# EasyEDA Pro project ProPrj_esp32无线遥控器_2025-02-07.epro

# Schematic Schematic1
Board Name: Board1; Create Date: 2024-12-05; Drawed: ZZRON
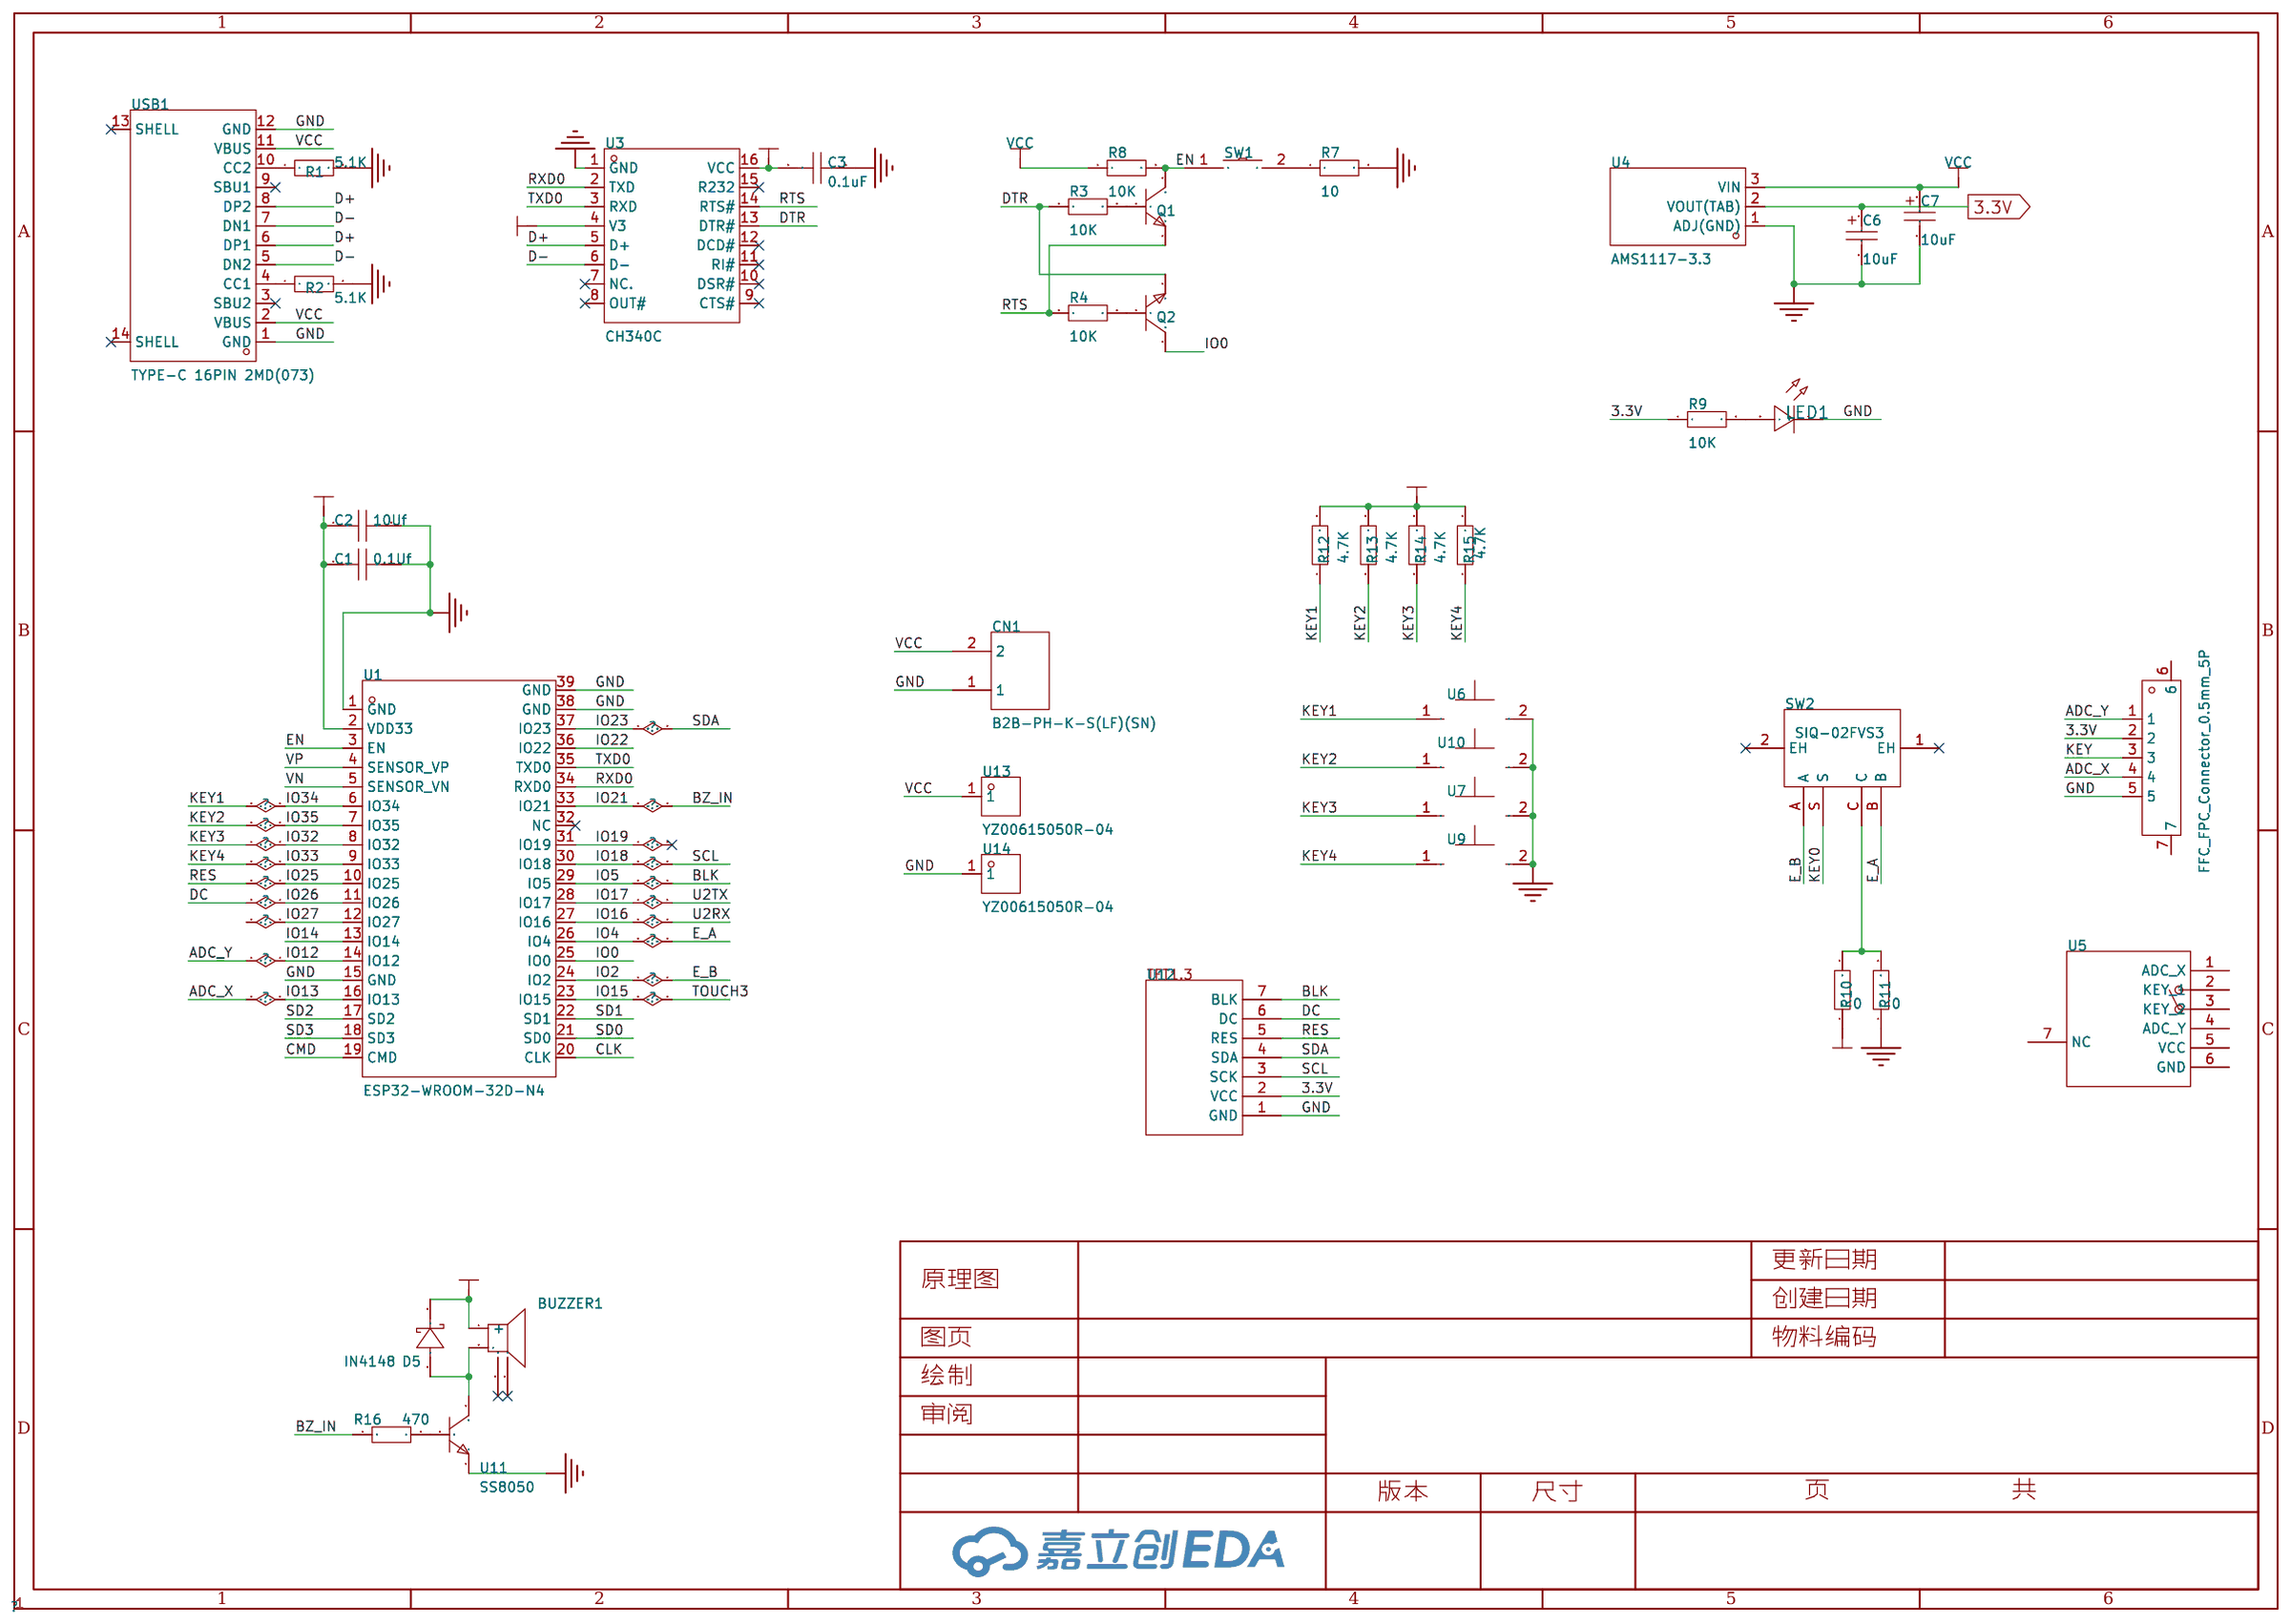
[diagram p0: schematic sheet]

## Parts
BUZZER1  2.7kHz  [BUZ-SMD_4P-L8.5-W8.5-P8.50-BR]
C1  0.1Uf  [C0603]
C2  10Uf  [C0603]
C3  0.1uF  [C0603]
C6  10uF  [CAP-SMD_L3.2-W1.6-RD-C7171]
C7  10uF  [CAP-SMD_L3.2-W1.6-RD-C7171]
CN1  B2B-PH-K-S(LF)(SN)  [CONN-TH_B2B-PH-K-S]
D5  IN4148  [SOD-123_L2.7-W1.6-LS3.7-FD]
FPC1  FFC_FPC_Connector_0.5mm_5P  [FPC-SMD_5P-P0.50-LIAN-FENG-YING]
LED1  -  [LED_0603]
Q1  -  [S8050_SOT-23]
Q2  -  [S8050_SOT-23]
R1  5.1K  [R0603]
R2  5.1K  [R0603]
R3  10K  [R0603]
R4  10K  [R0603]
R7  10  [R0603]
R8  10K  [R0603]
R9  10K  [R0603]
R10  0  [R0603]
R11  0  [R0603]
R12  4.7K  [R0603]
R13  4.7K  [R0603]
R14  4.7K  [R0603]
R15  4.7K  [R0603]
R16  470  [R0603]
SW1  TS-1101-C-W  [SW-SMD_L6.0-W3.3-LS8.0]
SW2  SIQ-02FVS3  [SW-SMD_SIQ-02FVS3]
U1  ESP32-WROOM-32D-N4  [WIFIM-SMD_39P-L25.5-W18.0-P1.27-BL]
U3  CH340C  [SOP-16_L10.0-W3.9-P1.27-LS6.0-BL]
U4  AMS1117-3.3  [SOT-89_L4.5-W2.5-P1.50-LS4.2-BR]
U5  -  [NS摇杆]
U6  SKPMAQE010  [KEY-SMD_2P-L6.0-W6.0-P6.00]
U7  SKPMAQE010  [KEY-SMD_2P-L6.0-W6.0-P6.00]
U9  SKPMAQE010  [KEY-SMD_2P-L6.0-W6.0-P6.00]
U10  SKPMAQE010  [KEY-SMD_2P-L6.0-W6.0-P6.00]
U11  SS8050  [SOT-23-3_L2.9-W1.3-P1.90-LS2.4-BR]
U12  -  [tft1.3寸]
U13  YZ00615050R-04  [SMD_BD2.0-L2.0-W2.0_C9900001905]
U14  YZ00615050R-04  [SMD_BD2.0-L2.0-W2.0_C9900001905]
USB1  TYPE-C 16PIN 2MD(073)  [USB-C-SMD_TYPE-C-6PIN-2MD-073]

## Library data of the parts
BUZZER1 = MLT-8530_C94599: 驱动方式:无源(外部驱动);构造类型:电磁式;频率:2.7kHz;声压(SPL):80dB@5V,10cm;; LCSC Part Name: MLT-8530; Supplier Part: C94599; Manufacturer: 华能; Manufacturer Part: MLT-8530; Supplier Footprint: SMD,8.5x8.5mm; JLCPCB Part Class: 扩展库; Datasheet: https://atta.szlcsc.com/upload/public/pdf/source/20170522/1495448322339.pdf; Supplier: LCSC; Oscillator Circuit: 无源(外部驱动); Technology Type: 电磁式; Operating Voltage: 2.5V~4.5V; Sound Pressure Level (SPL): 80dB@5V,10cm; Length: 8.5mm; Width: 8.5mm; Height: 3.3mm
C1-C3 = CAP_0603: Supplier Footprint: 0603
C6 C7 = TAJA106K016RNJ: 容值:10uF;精度:±10%;额定电压:16V;等效串联电阻:3Ω@100kHz;; LCSC Part Name: 10uF ±10% 16V; Supplier Part: C7171; Manufacturer: Kyocera AVX; Supplier Footprint: CASE-A-3216; JLCPCB Part Class: 基础库; Datasheet: https://atta.szlcsc.com/upload/public/pdf/source/20160107/1457707750344.pdf; Supplier: LCSC; Tolerance: ±10%; Rated Voltage: 16V; Equivalent Series Resistance(ESR): 3Ω@100kHz; Operating Temperature: -55℃~+125℃
CN1 = B2B-PH-K-S(LF)(SN): 插针结构:1x2P;间距:2mm;安装方式:直插;参考系列:PH;总PIN数:2P;排数:1;每排PIN数:2;行距:-;额定电流:2A;触头材质:黄铜;触头镀层:锡;工作温度范围:-25℃~+85℃;; LCSC Part Name: 1x2P 间距:2mm 直插 系列:PH; Supplier Part: C131337; Manufacturer: JST; Supplier Footprint: 插件,P=2mm; JLCPCB Part Class: 扩展库; Datasheet: https://atta.szlcsc.com/upload/public/pdf/source/20171026/C131342_15089839687311058815.pdf; Supplier: LCSC; Pins Structure: 1x2P; Pitch: 2mm; Mounting Style: 直插; Reference Series: PH; Number of Pins: 2P; Number of Rows: 1; Number of PINs Per Row: 2; Current Rating (Max): 2A; Contact Material: 黄铜; Contact Plating: 锡; Operating Temperature Range: -25℃~+85℃; Rated Voltage (Max): 100V; Plastic Material: PA66; Flame Retardant Rating: UL94V-0; Supplementary Features: 打K脚; Colour: 白色; Z-Height of the Board: 6mm; X-Length of Bottom Edge on Board (Spacing Line): 5.9mm; Y-Width of Bottom Edge on Board: 4.5mm
D5 = 1N4148W_C7420318: 二极管配置:独立式;正向压降(Vf):1.25V@150mA;直流反向耐压(Vr):100V;平均整流电流(Io):150mA;功率:400mW;反向恢复时间(trr):4ns;; LCSC Part Name: 电压:100V 电流:150mA; Supplier Part: C7420318; Manufacturer: 宏迦橙; Manufacturer Part: 1N4148W; Supplier Footprint: SOD-123; JLCPCB Part Class: 扩展库; Datasheet: https://atta.szlcsc.com/upload/public/pdf/source/20230828/E5C3F7A4272052930A7E03B75759BF50.pdf; Supplier: LCSC; Diode Configuration: 独立式; Forward Voltage (Vf@If): 1.25V@150mA; Reverse Voltage (Vr): 100V; Average Rectified Current (Io): 150mA; Power Dissipation: 400mW; Reverse Leakage Current: 1uA@75V; Reverse Recovery Time (trr): 4ns; Operating Temperature: -55℃~+150℃
FPC1 = FFC_FPC_Connector_0.5mm_5P: Supplier Part: C9900017273; Supplier Footprint: FPC-SMD_5P-P0.50; JLCPCB Part Class: 扩展库; Supplier: LCSC
LED1 = LED_0603-R: Supplier Footprint: 0603
Q1 Q2 = S8050_SOT_NPN: Supplier Footprint: SOT-23
R1-R4 R7-R16 = Res_0603: Supplier Footprint: 0603
SW1 = TS-1101-C-W: 电路结构:单刀单掷;按钮形状:矩形按钮;作用力:260gf;安装方式:立贴;开关长度:6mm;开关宽度:3.6mm;开关高度:2.5mm;带支架:不带;触点电流:50mA;额定电压(AC):-;额定电压(DC):12V;额定功率:-;绝缘电阻:-;带灯:无;机械寿命:5万次;; LCSC Part Name: 6*3.6*2.5mm 立贴 轻触开关; Supplier Part: C318938; Manufacturer: XKB Connectivity(中国星坤); Supplier Footprint: SMD; JLCPCB Part Class: 扩展库; Datasheet: https://atta.szlcsc.com/upload/public/pdf/source/20200227/C318938_C2E53B1EEDE37D980A33616AC086DE53.pdf; Supplier: LCSC; Circuit: 单刀单掷; Actuator Style: 矩形按钮; Operating Force: 260gf; Mounting Style: 立贴; Switch Length: 6mm; Switch Width: 3.6mm; Switch Height: 2.5mm; Strike Gundam: 不带; Contact Current: 50mA; Voltage Rating (DC): 12V; Actuator/Cap Color: 白色带淡绿; With Lamp: 无; Mechanical Life: 5万次; Operating Temperature: -30℃~+85℃
SW2 = SIQ-02FVS3_C29780879: 类型:10型回转型;; LCSC Part Name: 小电流编码器 SIQ-02FVS3 10型回转型; Supplier Part: C29780879; Manufacturer: SAMZO(三佐); Supplier Footprint: SMD-6P,14.5x14.5mm; JLCPCB Part Class: 扩展库; Datasheet: https://atta.szlcsc.com/upload/public/pdf/source/20240717/A20444FA5ECF664C9CA10B9031D1BED3.pdf; Supplier: LCSC; Type: 10型回转型
U1 = ESP32-WROOM-32D-N4: ESP32-WROOM-32D 集成 ESP32-D0WD，功能强大，用途广泛，可以用于低功耗传感器网络和要求极高的任务，例如语音编码、音频流和 MP3 解码等。; LCSC Part Name: 通用型Wi-Fi+BT+BLE MCU模组; Supplier Part: C473012; Manufacturer: ESPRESSIF(乐鑫); Supplier Footprint: SMD,18x25.5mm; JLCPCB Part Class: 扩展库; Datasheet: https://atta.szlcsc.com/upload/public/pdf/source/20191225/C473012_1E74417EE995DBCF17C94BD318A37DAB.pdf; Supplier: LCSC
U3 = CH340C: 应用功能:收发器;接口协议:USB 2.0;数据速率:2Mbps;; LCSC Part Name: CH340C USB转串口芯片 CH340; Supplier Part: C84681; Manufacturer: WCH(南京沁恒); Supplier Footprint: SOP-16; JLCPCB Part Class: Extended Part; Datasheet: https://atta.szlcsc.com/upload/public/pdf/source/20200819/C84681_ADBED554CE321879DBD6B1D06488689C.pdf; Supplier: LCSC; Applications Function: 收发器; Protocol: USB 2.0; Supply Voltage: 3.3V；5V; Data Rate: 2Mbps
U4 = AMS1117-3.3_C347256: 输出类型:固定;最大输入电压:12V;输出电压:3.3V;输出电流:1A;电源纹波抑制比(PSRR):60dB@(120Hz);输出极性:正极;; LCSC Part Name: 输出:3.3V 电流:1A 耐压:12V; Supplier Part: C347256; Manufacturer: UMW(友台半导体); Supplier Footprint: SOT-89; JLCPCB Part Class: 扩展库; Datasheet: https://atta.szlcsc.com/upload/public/pdf/source/20231109/155D79A26D9DB04352555A58D5969DC8.pdf; Supplier: LCSC; Output Type: 固定; Maximum Input Voltage: 12V; Output Voltage: 3.3V; Output Current: 1A; Power Supply Rejection Ratio (PSRR): 60dB@(120Hz); Dropout Voltage: 1.3V@(1A); Feature: 过流保护(OCP); Output Polarity: 正极; Number of Outputs: 1
U5 = NS摇杆
U6 U7 U9 U10 = SKPMAQE010: 6*6*5mm 立贴 硅胶软开关 无声静音开关 电路结构:单刀单掷 触点电流:50mA 额定电压(DC):16V 安装方式:立贴 动作力:3.5N 操作寿命:5万次 行程:1.3mm 用途:汽车音响,汽车导航,音响设备,手持设备,通讯设备,测量仪器等各种操作; Supplier Part: C19274389; Manufacturer: ALPSALPINE(阿尔卑斯阿尔派); Supplier Footprint: SMD,6.6x6mm; JLCPCB Part Class: 扩展库; Datasheet: https://atta.szlcsc.com/upload/public/pdf/source/20231201/D724ADF6978EA66A095344C51B88B412.pdf; Supplier: LCSC
U11 = SS8050_C7420370: 晶体管类型:NPN;集电极电流(Ic):1.5A;集射极击穿电压(Vceo):25V;功率(Pd):300mW;直流电流增益(hFE@Ic,Vce):120@100mA,1.0V;; LCSC Part Name: 耐压:25V 电流:1.5A NPN H档 200-350; Supplier Part: C7420370; Manufacturer: 宏迦橙; Supplier Footprint: SOT-23; JLCPCB Part Class: Extended Part; Datasheet: https://atta.szlcsc.com/upload/public/pdf/source/20231222/9C4050A7669EB24B3ACD0418218817FD.pdf; Supplier: LCSC; Transistor Type: NPN; Collector Current (Ic): 1.5A; Collector-Emitter Breakdown Voltage (Vceo): 25V; Power Dissipation (Pd): 300mW; DC Current Gain (hFE@Ic,Vce): 120@100mA,1.0V; Transition Frequency (fT): 100MHz; Collector Cut-Off Current (Icbo): 100nA; Collector-Emitter Saturation Voltage (VCE(sat)@Ic,Ib): 500mV@800mA,80mA; Operating Temperature: -55℃~+150℃
U12 = tft1.3寸
U13 U14 = YZ00615050R-04: 类型:弹簧顶针(POGO PIN);PIN位数:单PIN位;全长/全高:5mm;工作高度:4mm;接触电阻:50mΩ;弹性寿命:10000次;额定电流:1A;额定电压:12V;触头材质:黄铜;触头镀层:金;工作温度范围:-20℃~+70℃;; LCSC Part Name: POGO PIN贴片型弹簧顶针; Supplier Part: C5157400; Manufacturer: Xinyangze(鑫扬泽); JLCPCB Part Class: 扩展库; Datasheet: https://atta.szlcsc.com/upload/public/pdf/source/20220920/E1BBBB2DFDF8BC7AC0952AE958341EB4.pdf; Supplier: LCSC; Type: 弹簧顶针(POGO PIN); Number of Pins: 单PIN位; Overall Length/Height: 5mm; Operational Height: 4mm; Contact Resistance: 50mΩ; Elastic Life: 10000次; Rated Current: 1A; Rated Voltage: 12V; Contact Material: 黄铜; Contact Plating: 金; Operating Temperature Range: -20℃~+70℃
USB1 = TYPE-C 16PIN 2MD(073): 连接器类型:Type-C;标准:USB 3.1;公母:母;安装方式:卧贴;触点数量:16P;端口数量:1;额定电流 - 电源:5A;工作温度范围:-25℃~+85℃;; LCSC Part Name: Type-C 母 卧贴; Supplier Part: C2765186; Manufacturer: SHOU HAN(首韩); Supplier Footprint: SMD; JLCPCB Part Class: 扩展库; Datasheet: https://atta.szlcsc.com/upload/public/pdf/source/20211123/39B17C16241EAC15C5E277BDA434118E.pdf; Supplier: LCSC; Connector Type: Type-C; Standard: USB 3.1; Gender: 母; Mounting Style: 卧贴; Number of Contacts: 16P; Number of Ports: 1; Current Rating - Power (Max): 5A; Operating Temperature Range: -25℃~+85℃; Rated Voltage (Max): 5V; Connect-Disconnect Life: 5千次; Core Colour: 黑色

## Nets
3.3V: BUZZER1.1(+) C1.1 C2.1 C3.2 C6.1 D5.2(K) FPC1.2 R9.1 R10.1 R12.2 R13.2 R14.2 R15.2 U1.2(VDD33) U3.4(V3) U3.16(VCC) U4.2(VOUT(TAB)) U12.2(VCC)
GND: C1.2 C2.2 C3.1 C6.2 C7.2 CN1.1 FPC1.5 LED1.1(C) R1.2 R2.2 R7.2 R11.1 U1.1(GND) U1.15(GND) U1.38(GND) U1.39(GND) U3.1(GND) U4.1(ADJ(GND)) U6.2 U7.2 U9.2 U10.2 U11.2(E) U12.1(GND) U14.1 USB1.1(GND) USB1.12(GND)
VCC: C7.1 CN1.2 R8.1 U4.3(VIN) U13.1 USB1.2(VBUS) USB1.11(VBUS)
ADC_X: FPC1.4 U1.16(IO13)
ADC_Y: FPC1.1 U1.14(IO12)
BLK: U1.29(IO5) U12.7(BLK)
BZ_IN: R16.1 U1.33(IO21)
CLK: U1.20(CLK)
CMD: U1.19(CMD)
D+: U3.5(D+) USB1.6(DP1) USB1.8(DP2)
D-: U3.6(D-) USB1.5(DN2) USB1.7(DN1)
DC: U1.11(IO26) U12.6(DC)
DTR: Q2.2 R3.1 U3.13(DTR#)
E_A: SW2.B U1.26(IO4)
E_B: SW2.A U1.24(IO2)
EN: Q1.3 R8.2 SW1.1 U1.3(EN)
IO0: Q2.3 U1.25(IO0)
IO14: U1.13(IO14)
IO15: U1.23(IO15)
IO16: U1.27(IO16)
IO17: U1.28(IO17)
IO18: U1.30(IO18) U12.3(SCK)
IO19: U1.31(IO19)
IO22: U1.36(IO22)
IO23: U1.37(IO23) U12.4(SDA)
IO25: U1.10(IO25) U12.5(RES)
IO27: U1.12(IO27)
IO32: R14.1 U1.8(IO32) U7.1
IO33: R15.1 U1.9(IO33) U9.1
IO34: R12.1 U1.6(IO34) U6.1
IO35: R13.1 U1.7(IO35) U10.1
KEY: FPC1.3
KEY0: SW2.S
RTS: Q1.2 R4.1 U3.14(RTS#)
RXD0: U1.34(RXD0) U3.2(TXD)
SD0: U1.21(SD0)
SD1: U1.22(SD1)
SD2: U1.17(SD2)
SD3: U1.18(SD3)
TXD0: U1.35(TXD0) U3.3(RXD)
VN: U1.5(SENSOR_VN)
VP: U1.4(SENSOR_VP)
$1N966: R1.1 USB1.10(CC2)
$1N992: R2.1 USB1.4(CC1)
$1N1730: Q2.1 R4.2
$1N1739: Q1.1 R3.2
$1N1740: R7.1 SW1.2
$1N2539: LED1.2(A) R9.2
$1N3788: R10.2 R11.2 SW2.C
$1N5400: BUZZER1.2 D5.1(A) U11.3(C)
$1N5401: R16.2 U11.1(B)

Not connected (* = marked no-connect by the designer): BUZZER1 3* 4*; FPC1 6 7; SW2 1(EH)* 2(EH)*; U1 32(NC)*; U3 7(NC.)* 8(OUT#)* 9(CTS#)* 10(DSR#)* 11(RI#)* 12(DCD#)* 15(R232)*; U5 1(ADC_X) 2(KEY_1) 3(KEY_2) 4(ADC_Y) 5(VCC) 6(GND) 7(NC); USB1 3(SBU2)* 9(SBU1)* 13(SHELL)* 14(SHELL)*

# Board PCB1
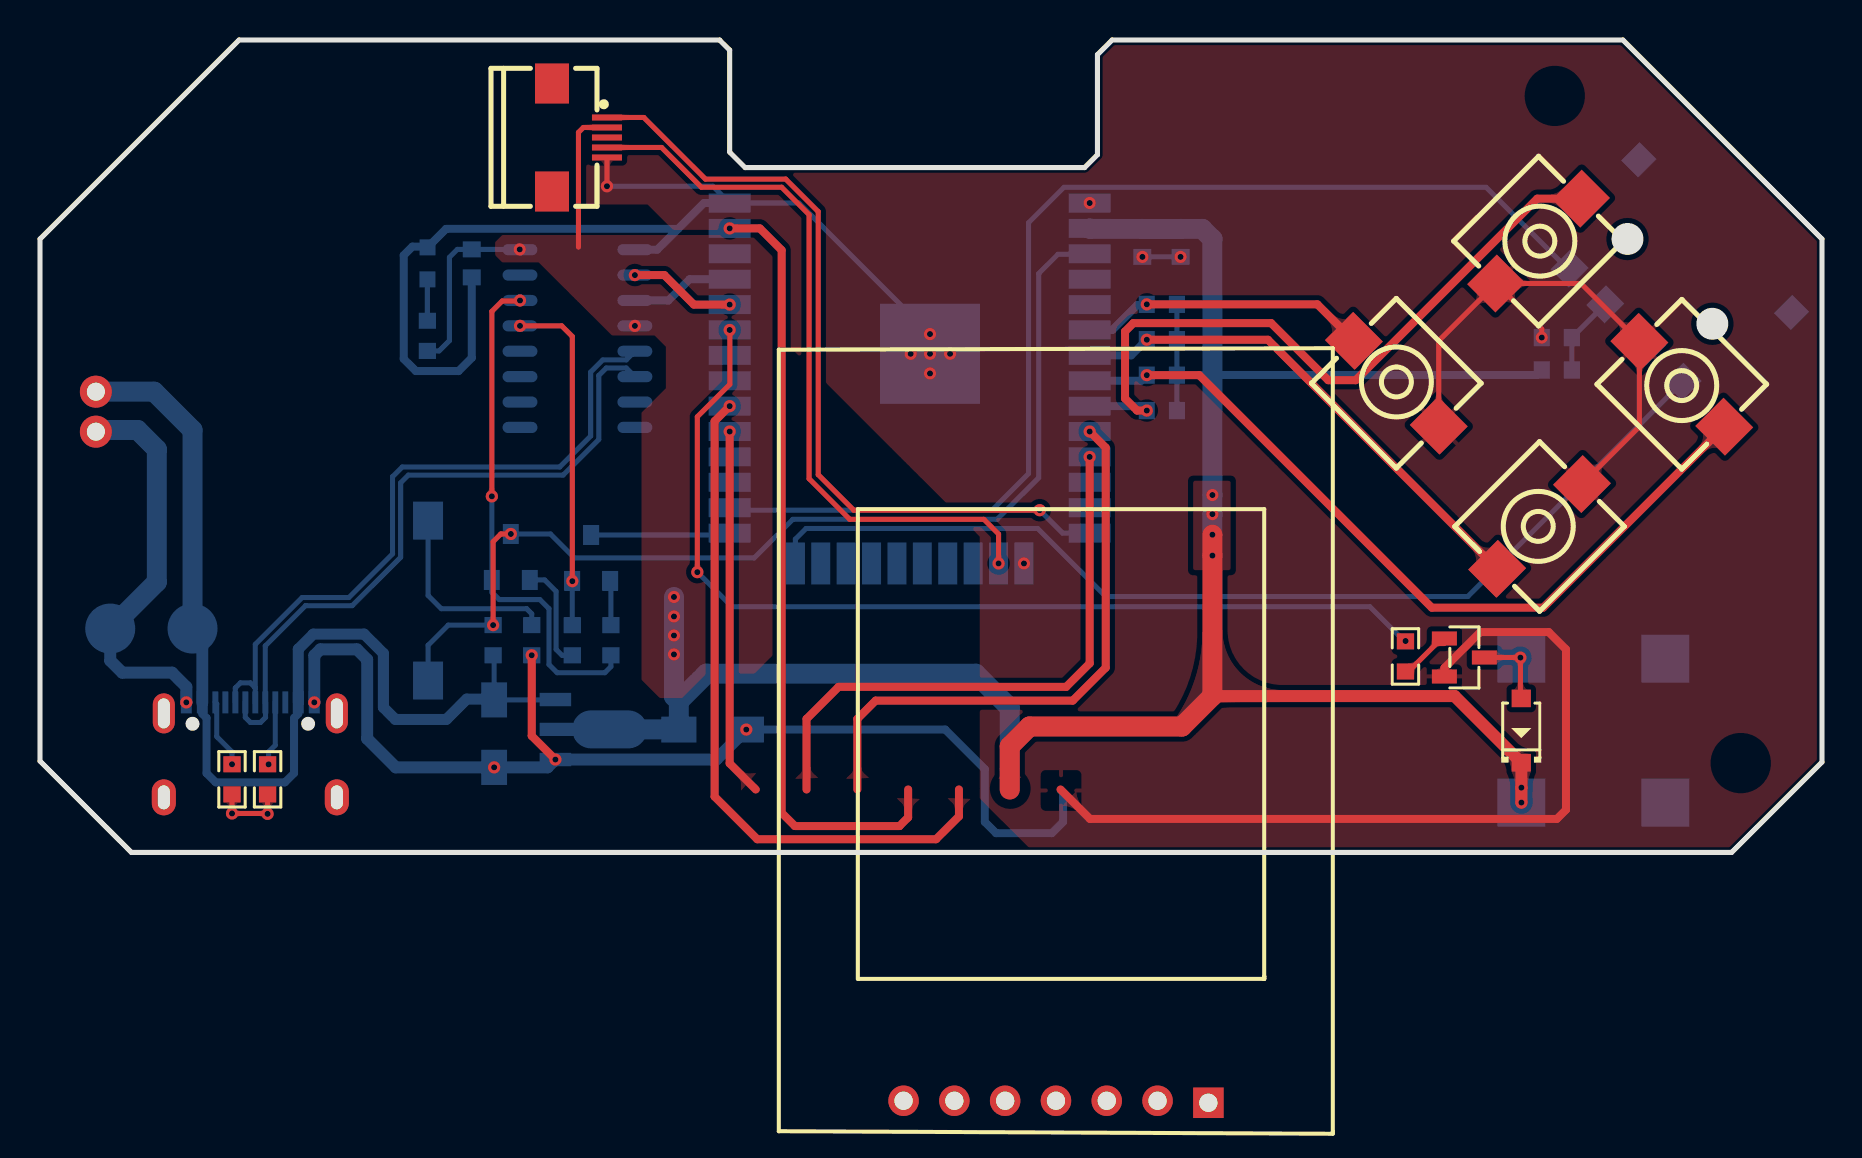
[diagram p1: board, top side]
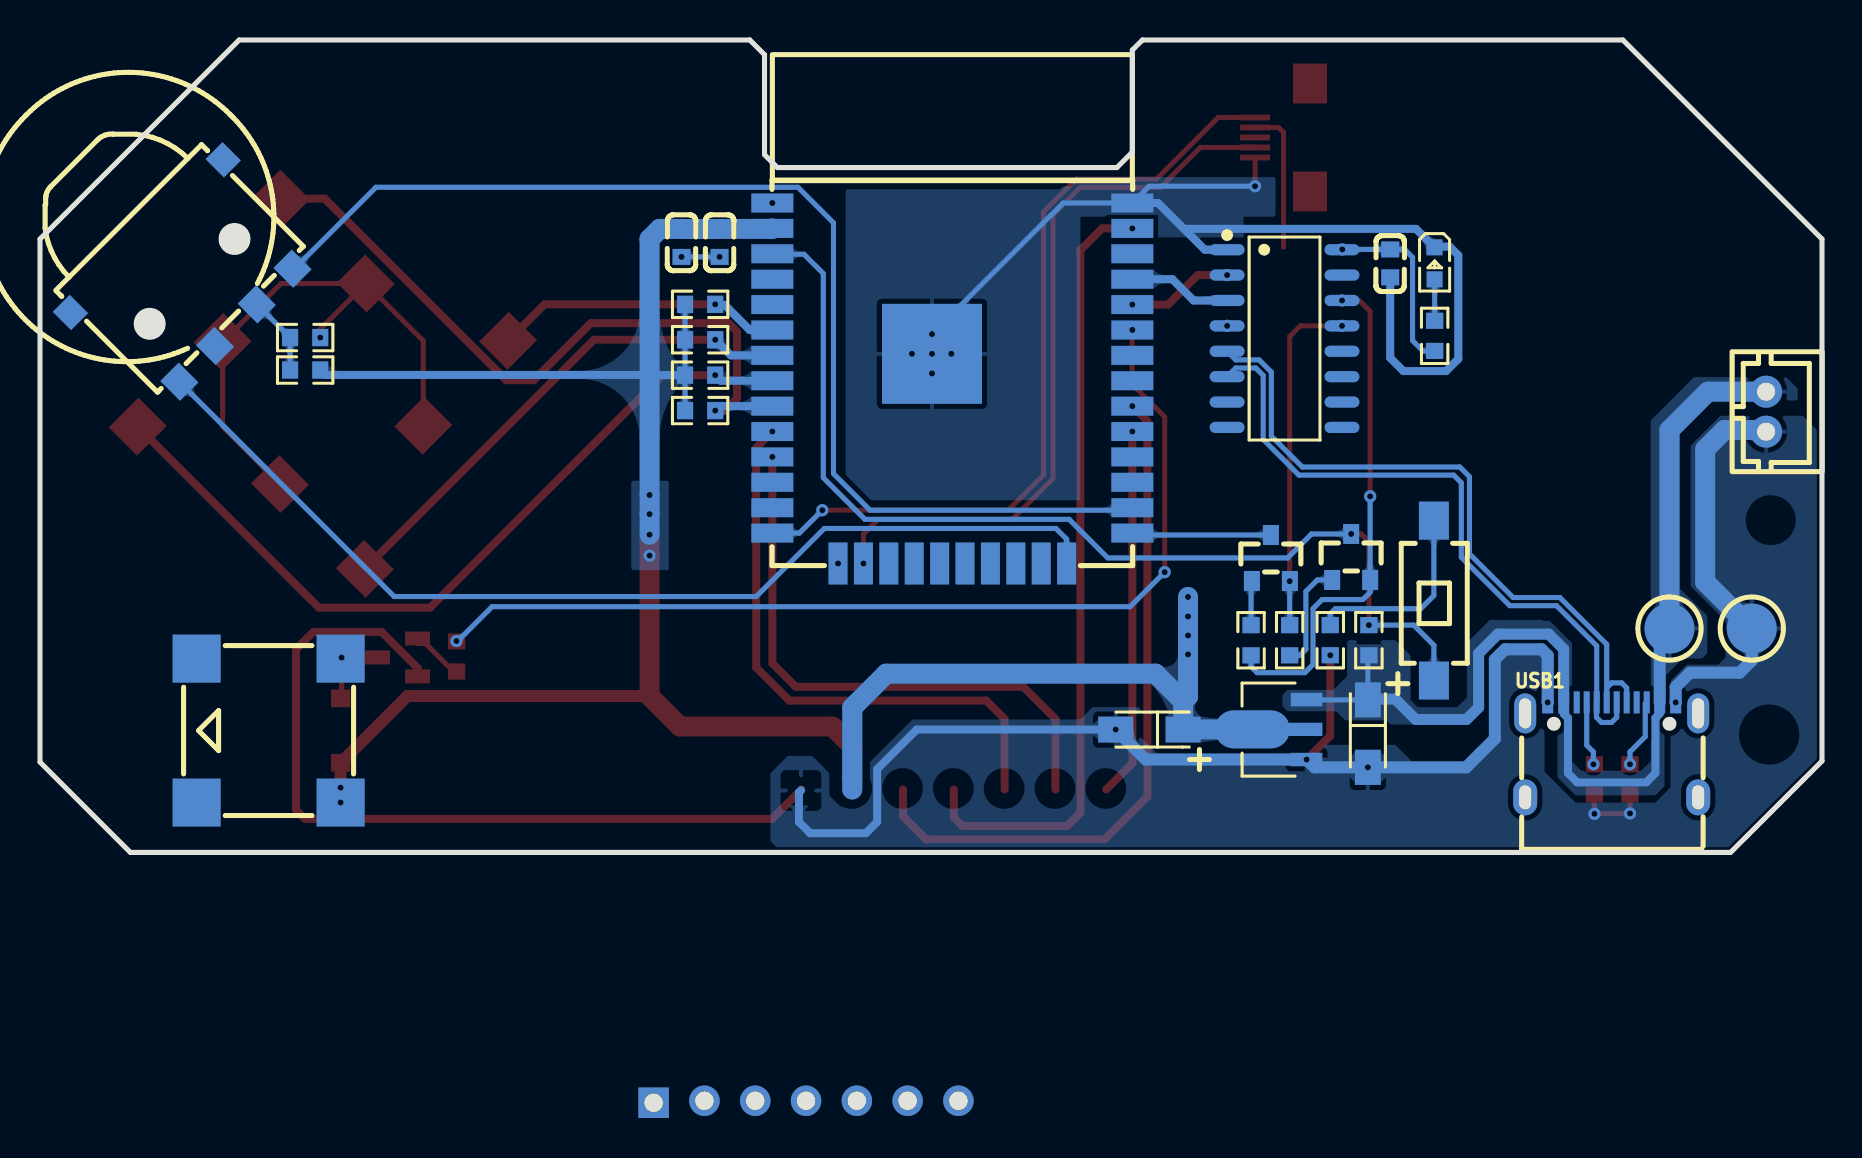
[diagram p2: board, bottom side, seen from below]

Outline 89.1 x 40.64 mm; copper layers: Top Layer, Bottom Layer. Coordinates in mm from the lower left corner of the outline.
Outline path: 0,30.68 0,4.57 4.57,0 84.58,0 89.1,4.52 89.1,30.68 79.15,40.64 53.61,40.64 52.87,39.9 52.87,34.9 52.23,34.26 35.26,34.26 34.48,35.03 34.48,40.13 33.98,40.64 9.96,40.64 0,30.68
Stack: Top Layer 0.035mm / Dielectric1 1.51mm FR4 er 4.5 / Bottom Layer 0.035mm

## Design rules (mm)
net RXD0: DP2
net TXD0: DP2
net D+: DP1
net D-: DP1
template: JLCPCB Capability(Two Layers Board)
spacing copperThickness1oz (default): track to track 0.102, other pairs 0.152 to 0.3
spacing copperThickness2oz: track to track 0.203, other pairs 0.152 to 0.3
track width copperThickness1oz (default): min 0.127, default 0.254, max 2.54
track width copperThickness2oz: min 0.203, default 0.254, max 2.54
differential pair differentialPair (default): width min 0.127, default 0.254, max 2.54; gap min 0.152, default 0.152
via viaSize (default): diameter min 0.5, default 0.61, max 10; hole min 0.3, default 0.305, max 6.3

## Placement (name value [footprint] x y rotation side)
BUZZER1  2.7kHz  [BUZ-SMD_4P-L8.5-W8.5-P8.50-BR]  77.67 6.1 90 bottom
C1  0.1Uf  [C0603]  55.12 30.49 270 bottom
C2  10Uf  [C0603]  57.03 30.49 270 bottom
C3  0.1uF  [C0603]  21.59 29.46 90 bottom
C6  10uF  [CAP-SMD_L3.2-W1.6-RD-C7171]  33.63 6.15 0 bottom
C7  10uF  [CAP-SMD_L3.2-W1.6-RD-C7171]  22.71 5.94 270 bottom
CN1  B2B-PH-K-S(LF)(SN)  [CONN-TH_B2B-PH-K-S]  2.79 22.05 270 bottom
D5  IN4148  [SOD-123_L2.7-W1.6-LS3.7-FD]  74.07 6.1 270 top
FPC1  FFC_FPC_Connector_0.5mm_5P  [FPC-SMD_5P-P0.50-LIAN-FENG-YING]  26.98 35.76 270 top
LED1  -  [LED_0603]  19.37 29.42 270 bottom
Q1  -  [S8050_SOT-23]  23.67 14.78 270 bottom
Q2  -  [S8050_SOT-23]  27.68 14.73 270 bottom
R1  5.1K  [R0603]  9.6 3.66 270 top
R2  5.1K  [R0603]  11.38 3.66 270 top
R3  10K  [R0603]  26.62 10.61 270 bottom
R4  10K  [R0603]  28.55 10.61 90 bottom
R7  10  [R0603]  24.59 10.62 270 bottom
R8  10K  [R0603]  22.66 10.62 90 bottom
R9  10K  [R0603]  19.37 25.84 90 bottom
R10  0  [R0603]  75.84 24.13 0 bottom
R11  0  [R0603]  75.84 25.76 0 bottom
R12  4.7K  [R0603]  56.1 27.42 0 bottom
R13  4.7K  [R0603]  56.1 25.65 0 bottom
R14  4.7K  [R0603]  56.1 23.87 0 bottom
R15  4.7K  [R0603]  56.1 22.1 0 bottom
R16  470  [R0603]  68.28 9.8 270 top
SW1  TS-1101-C-W  [SW-SMD_L6.0-W3.3-LS8.0]  19.41 12.6 90 bottom
SW2  SIQ-02FVS3  [SW-SMD_SIQ-02FVS3]  81.53 28.6 135 bottom
U1  ESP32-WROOM-32D-N4  [WIFIM-SMD_39P-L25.5-W18.0-P1.27-BL]  43.48 23.47 270 bottom
U3  CH340C  [SOP-16_L10.0-W3.9-P1.27-LS6.0-BL]  26.87 25.7 270 bottom
U4  AMS1117-3.3  [SOT-89_L4.5-W2.5-P1.50-LS4.2-BR]  27.13 6.15 180 bottom
U6  SKPMAQE010  [KEY-SMD_2P-L6.0-W6.0-P6.00]  67.82 23.47 315 top
U7  SKPMAQE010  [KEY-SMD_2P-L6.0-W6.0-P6.00]  82.09 23.42 135 top
U9  SKPMAQE010  [KEY-SMD_2P-L6.0-W6.0-P6.00]  74.93 30.58 225 top
U10  SKPMAQE010  [KEY-SMD_2P-L6.0-W6.0-P6.00]  74.98 16.31 45 top
U11  SS8050  [SOT-23-3_L2.9-W1.3-P1.90-LS2.4-BR]  71.22 9.75 180 top
U12  -  [tft1.3寸]  51.05 3.1 180 top
U13  YZ00615050R-04  [SMD_BD2.0-L2.0-W2.0_C9900001905]  7.63 11.2 180 bottom
U14  YZ00615050R-04  [SMD_BD2.0-L2.0-W2.0_C9900001905]  3.51 11.2 180 bottom
USB1  TYPE-C 16PIN 2MD(073)  [USB-C-SMD_TYPE-C-6PIN-2MD-073]  10.52 5.13 180 bottom

## Footprints (pads in the part's own frame, mm; a bottom-side part is the same pattern mirrored in y, then rotated)
BUZ-SMD_4P-L8.5-W8.5-P8.50-BR
  rect 2.4x2.4 smd: 1(-3.6,-3.6) 2(3.6,-3.6) 3(3.599,3.599) 4(-3.6,3.6)
C0603
  rect 0.8x0.9 smd: 1(-0.7,0) 2(0.7,0)
CAP-SMD_L3.2-W1.6-RD-C7171
  rect 1.758x1.296 smd: 1(-1.687,0) 2(1.687,0)
CONN-TH_B2B-PH-K-S
  round 1.6 hole 0.9: 1(1,0) 2(-1,0)
FPC-SMD_5P-P0.50-LIAN-FENG-YING
  rect 0.3x1.5 smd: 1(-1,1.375) 2(-0.5,1.375) 3(0,1.375) 4(0.5,1.375) 5(1,1.375)
  rect 2x1.7 smd: 6(2.7,-1.375) 7(-2.7,-1.375)
KEY-SMD_2P-L6.0-W6.0-P6.00
  rect 2.1x2 smd: 1(-3,0) 2(3,0)
LED_0603
  rect 0.8x0.8 smd: 1(-0.851,-0.01) 2(0.75,-0.005)
R0603
  rect 0.806x0.864 smd: 1(-0.753,0) 2(0.753,0)
S8050_SOT-23
  rect 1x0.8 smd: 1(1.15,-0.823) 2(1.15,1.077) 3(-1.15,0.127)
SMD_BD2.0-L2.0-W2.0_C9900001905
  round 2.5 smd: 1(0,0)
SOD-123_L2.7-W1.6-LS3.7-FD
  rect 0.88x0.96 smd: 1(-1.61,0) 2(1.61,0)
SOP-16_L10.0-W3.9-P1.27-LS6.0-BL
  oval 0.56x1.745 smd: 1(-4.445,-2.873) 2(-3.175,-2.873) 3(-1.905,-2.873) 4(-0.635,-2.873) 5(0.635,-2.873) 6(1.905,-2.873) 7(3.175,-2.873) 8(4.445,-2.873) 9(4.445,2.873) 10(3.175,2.873) 11(1.905,2.873) 12(0.635,2.873) 13(-0.635,2.873) 14(-1.905,2.873) 15(-3.175,2.873) 16(-4.445,2.873)
SOT-23-3_L2.9-W1.3-P1.90-LS2.4-BR
  rect 1.25x0.7 smd: 1(1,-0.95) 2(1,0.95) 3(-1,0)
SOT-89_L4.5-W2.5-P1.50-LS4.2-BR
  rect 1.575x0.672 smd: 1(1.356,-1.5) 3(1.356,1.5)
  custom 5.377x1.9 smd: 2(-1.356,0.009)
SW-SMD_L6.0-W3.3-LS8.0
  rect 1.9x1.5 smd: 1(-4,0) 2(4,0)
SW-SMD_SIQ-02FVS3
  rect 1.2x1.3 smd: 1(-5.4,3.15) 2(5.4,3.15)
  rect 1.3x1.4 smd: A(-4,-3.15) B(4,-3.15) C(1.475,-3.15) S(-1.475,-3.15)
tft1.3寸
  rect 1.524x1.524 hole 0.914: 1(-7.366,15.621)
  round 1.524 hole 0.914: 2(-4.826,15.52) 3(-2.286,15.52) 4(0.254,15.52) 5(2.794,15.52) 6(5.334,15.52) 7(7.874,15.52)
USB-C-SMD_TYPE-C-6PIN-2MD-073
  rect 0.55x1.1 smd: 1(-3.2,2.375) 2(-2.4,2.375) 11(2.4,2.375) 12(3.2,2.375)
  rect 0.3x1.1 smd: 3(-1.75,2.375) 4(-1.25,2.375) 5(-0.75,2.375) 6(-0.25,2.375) 7(0.25,2.375) 8(0.75,2.375) 9(1.25,2.375) 10(1.75,2.375)
  oval 1.2x1.8 hole 0.6x1.2: 13(-4.325,-2.375) 14(4.325,-2.375)
  oval 1.1x2 hole 0.6x1.5: 13(-4.325,1.825) 14(4.325,1.825)
WIFIM-SMD_39P-L25.5-W18.0-P1.27-BL
  rect 0.95x2.1 smd: 1(-9.015,-9) 2(-7.745,-9) 3(-6.475,-9) 4(-5.205,-9) 5(-3.935,-9) 6(-2.665,-9) 7(-1.395,-9) 8(-0.125,-9) 9(1.145,-9) 10(2.415,-9) 11(3.685,-9) 12(4.955,-9) 13(6.225,-9) 14(7.495,-9) 25(7.495,9) 26(6.225,9) 27(4.955,9) 28(3.685,9) 29(2.415,9) 30(1.145,9) 31(-0.125,9) 32(-1.395,9) 33(-2.665,9) 34(-3.935,9) 35(-5.205,9) 36(-6.475,9) 37(-7.745,9) 38(-9.015,9)
  rect 2.1x0.95 smd: 15(9.015,-5.715) 16(9.015,-4.445) 17(9.015,-3.175) 18(9.015,-1.905) 19(9.015,-0.635) 20(9.015,0.635) 21(9.015,1.905) 22(9.015,3.175) 23(9.015,4.445) 24(9.015,5.715)
  rect 5x5 smd: 39(-1.472,-1.017)

## Nets
As in the schematic.

Pads without a net: BUZZER1 3 4; FPC1 6 7; SW2 1 2; U1 32; U3 7 8 9 10 11 12 15; USB1 3 9 13 14

## Via types
v1: diameter 0.61, hole 0.305, Top Layer to Bottom Layer, 56 vias

## Routing (per net, layer and track width the routed paths; a pad name or vN(x,y) marks a point on that pad's centre or on a via; arc(x,y) is an arc through that point)
3.3V: length 133.6
  Top Layer w0.254: FPC1.2 27.17,36.26 26.92,36.02 26.92,30.28
  Top Layer w0.6: 58.62,7.82 70.73,7.82 D5.2 74.07,4.48 v1(74.07,3.24) v1(74.07,2.5)
  Top Layer w1: v1(58.62,15.89) v1(58.62,14.85) 58.62,7.82 57.1,6.3 49.48,6.3 48.49,5.31 48.49,3.15
  Bottom Layer w0.254: R9.1 19.96,25.09 20.47,25.6 20.47,29.77 20.87,30.16 C3.2 v1(23.99,30.16) U3.16 ; R12.2 R13.2 R14.2 R15.2
  Bottom Layer w0.4: R14.2 58.61,23.87 58.62,23.89 74.85,23.89 R10.1
  Bottom Layer w1: U4.2 31.93,6.16 C6.1 31.94,7.56 ; v1(58.62,15.89) v1(58.62,16.92) v1(58.62,17.88) 58.62,30.68 58.12,31.19 C2.1 57.02,31.19 55.13,31.19 C1.1 52.51,31.19 U1.2 ; 31.94,7.56 33.32,8.94 46.79,8.94 48.49,7.24 48.49,3.15 ; 31.94,7.56 31.7,7.8 v1(31.7,9.91) v1(31.7,10.85) v1(31.7,11.8) v1(31.7,12.78)
  vias: v1(29.75,26.34)
GND: length 206.6
  Top Layer w0.254: U10.2 79.97,21.3 U7.2 77.05,28.46 U9.2 ; U6.2 69.94,25.59 U9.2 ; FPC1.5 v1(28.35,33.32) ; U9.2 75.09,26.18 v1(75.09,25.76) ; R2.2 v1(11.38,1.93) 11.36,1.95 v1(9.6,1.95) R1.2
  Top Layer w0.4: 51.03,3.15 52.5,1.68 75.84,1.68 76.3,2.13 76.3,10.16 75.44,11.02 72.01,11.02 70.22,9.23 U11.2 ; v1(25.77,4.65) 24.59,5.83 v1(24.59,9.86)
  Bottom Layer w0.254: v1(57.03,29.79) v1(55.12,29.79) ; v1(28.35,33.32) 33.64,33.32 U1.38 37.95,32.48 v1(44.5,25.93)
  Bottom Layer w0.4: 51.05,3.1 51.16,3 51.16,1.52 50.6,0.97 47.8,0.97 47.24,1.52 47.24,4.17 45.26,6.15 v1(35.32,6.15) ; 31.9,31.19 20.3,31.19 LED1.1 19.34,30.3 18.62,30.3 18.19,29.87 18.19,24.69 18.8,24.08 20.93,24.08 21.59,24.74 C3.1 ; 31.9,31.19 30.86,30.15 U3.1 ; 31.9,31.19 33.2,32.48 U1.38
  Bottom Layer w0.6: v1(13.72,7.51) 13.72,9.85 14.02,10.16 15.85,10.16 16.36,9.65 16.36,5.69 17.79,4.26 v1(22.71,4.26) 25.38,4.26 v1(25.77,4.65) 33.82,4.65 v1(35.32,6.15) ; v1(7.32,7.51) 7.32,8.28 6.6,8.99 4.11,8.99 3.51,9.59 U14.1
  Bottom Layer w1: U14.1 5.84,13.53 5.84,20.17 4.88,21.13 2.88,21.13 CN1.1
  vias: v1(43.54,24.94) v1(44.5,24.94) v1(44.5,23.96) v1(45.51,24.94) v1(49.2,14.45) v1(52.48,32.48)
VCC: length 53.3
  Bottom Layer w0.254: 25.77,7.65 25.75,7.63 C7.1 22.71,9.81 R8.1
  Bottom Layer w0.4: 8.12,7.51 8.12,6.94 8.33,6.73 8.33,3.97 8.79,3.5 12.24,3.5 12.7,3.97 12.7,6.73 12.92,6.94 12.92,7.51
  Bottom Layer w0.55: 12.92,7.51 12.92,10.17 13.67,10.92 16.21,10.92 17.17,9.96 17.17,7.25 17.77,6.65 20.32,6.65 21.34,7.67 22.67,7.67 C7.1
  Bottom Layer w0.6: U13.1 8.12,10.71 8.12,7.51
  Bottom Layer w1: CN1.2 5.71,23.05 7.63,21.13 U13.1
ADC_X: length 36.8
  Top Layer w0.254: FPC1.4 31.08,35.26 33.07,33.27 37.08,33.27 38.46,31.9 38.46,18.69 40.49,16.66 47.19,16.66 47.93,15.93 47.93,14.4
  vias: v1(47.93,14.45)
ADC_Y: length 40.5
  Top Layer w0.254: v1(49.99,17.12) 40.69,17.12 38.91,18.9 38.91,32.05 37.29,33.68 33.27,33.68 30.19,36.76 FPC1.1
  Bottom Layer w0.254: U1.14 51.13,15.97 v1(49.99,17.12)
BLK: length 18.4
  Top Layer w0.4: 35.79,3.15 34.48,4.45 v1(34.48,21.05)
BZ_IN: length 49.6
  Top Layer w0.254: v1(32.87,14.02) 32.87,21.79 34.49,23.42 34.49,26.06
  Bottom Layer w0.254: v1(32.87,14.02) 34.6,12.29 66.5,12.29 68.21,10.58 v1(68.28,10.58)
  vias: v1(34.48,26.13)
D+: length 34
  Bottom Layer w0.254: 10.77,8.23 10.72,8.28 10.52,8.48 10.02,8.48 9.77,8.23 USB1.8 ; 10.77,8.23 USB1.6 ; 10.77,8.23 10.77,10.41 13.11,12.75 15.44,12.75 17.63,14.94 17.63,18.8 18.11,19.28 25.99,19.28 27.53,20.83 27.53,24.03 28.14,24.64 29.31,24.64 U3.5
D-: length 34
  Bottom Layer w0.254: USB1.7 10.27,6.76 10.52,6.5 11.02,6.5 11.28,6.76 11.28,7.49 USB1.5 11.27,10.33 13.28,12.34 15.61,12.34 18.03,14.77 18.03,18.49 18.42,18.87 26.15,18.87 27.94,20.66 27.94,23.86 28.31,24.23 29.31,24.23 U3.6
DC: length 29.2
  Top Layer w0.4: 38.33,3.15 38.33,6.68 39.93,8.28 51.31,8.28 52.48,9.46 v1(52.48,19.78)
DTR: length 17.3
  Top Layer w0.254: v1(26.62,13.57) 26.62,25.81 26.09,26.34 v1(24,26.34)
  Bottom Layer w0.254: Q2.2 v1(26.62,13.57) R3.1
E_A: length 57.8
  Bottom Layer w0.254: 34.48,17.14 34.51,17.12 47.6,17.12 49.43,18.95 49.43,31.5 51.21,33.27 72.3,33.27 76.48,29.1
E_B: length 51.7
  Bottom Layer w0.254: SW2.A 71.39,12.8 53.29,12.8 49.89,16.2 38.3,16.2 37.77,15.67 U1.24
EN: length 52.4
  Top Layer w0.254: v1(22.66,11.37) 22.66,15.54 23.04,15.93 v1(23.54,15.93)
  Bottom Layer w0.254: v1(22.66,11.37) 20.41,11.37 19.41,10.36 SW1.1 ; v1(23.54,15.93) 25.52,15.93 26.72,14.73 35.71,14.73 37.64,16.66 47.85,16.66 49.94,18.74 49.94,28.96 50.9,29.92 52.46,29.92 U1.3
IO0: length 7
  Bottom Layer w0.254: Q2.3 34.39,15.88 U1.25
IO18: length 34.8
  Top Layer w0.4: v1(34.48,22.32) 33.73,21.57 33.73,2.79 35.86,0.66 44.8,0.66 45.95,1.81 45.95,3.15
IO23: length 39.4
  Top Layer w0.4: v1(34.48,31.21) 35.99,31.21 37.08,30.12 37.08,1.98 37.74,1.32 42.98,1.32 43.41,1.75 43.41,3.15
IO25: length 29.2
  Top Layer w0.4: v1(52.48,21.05) 53.29,20.25 53.29,9.25 51.64,7.59 41.78,7.59 40.87,6.68 40.87,3.15
IO32: length 40.4
  Top Layer w0.4: U7.1 75.16,12.24 69.6,12.24 57.96,23.87 v1(55.34,23.87)
  Bottom Layer w0.4: U1.8 55.06,23.59 v1(55.34,23.87)
IO33: length 35.6
  Top Layer w0.4: v1(55.34,22.1) 54.86,22.1 54.25,22.71 54.25,26.06 54.67,26.48 61.56,26.48 64.41,23.62 65.79,23.62 74.87,32.7 U9.1
  Bottom Layer w0.4: v1(55.34,22.1) 55.12,22.32 U1.9
IO34: length 14.5
  Top Layer w0.4: U6.1 63.87,27.42 v1(55.34,27.42)
  Bottom Layer w0.4: v1(55.34,27.42) 55.31,27.38 54.86,27.38 53.62,26.13 U1.6
IO35: length 25.4
  Top Layer w0.4: U10.1 61.4,25.65 v1(55.34,25.65)
  Bottom Layer w0.4: v1(55.34,25.65) 54.56,24.86 U1.7
RTS: length 25.6
  Top Layer w0.254: v1(22.59,17.81) 22.59,27.06 23.11,27.58 23.98,27.58 v1(24,27.61)
  Bottom Layer w0.254: v1(22.59,17.81) Q1.2 22.59,13.02 22.96,12.65 24.99,12.65 25.45,12.19 25.45,9.4 25.86,8.99 28.24,8.99 28.55,9.29 R4.1
RXD0: length 5.3
  Top Layer w0.4: v1(29.75,28.88) 31.22,28.88 32.69,27.4 v1(34.48,27.4)
TXD0: length 5.2
  Bottom Layer w0.4: U1.35 32.48,28.67 31.42,27.61 U3.3
$1N966: length 3.4
  Bottom Layer w0.254: USB1.10 8.84,7.43 8.84,5.79 9.6,5.03 v1(9.6,4.41)
$1N992: length 3.2
  Bottom Layer w0.254: v1(11.43,4.41) 11.43,5.03 11.77,5.36 USB1.4
$1N1730: length 2.2
  Bottom Layer w0.254: R4.2 28.55,13.54 Q2.1
$1N1739: length 5.4
  Bottom Layer w0.254: Q1.1 25.23,13.63 25.81,13.06 25.81,10.16 26.11,9.86 R3.2
$1N1740: length 9.9
  Bottom Layer w0.254: R7.1 24.59,11.94 24.33,12.19 20.07,12.19 19.41,12.85 SW1.2
$1N2539: length 2.1
  Bottom Layer w0.254: LED1.2 19.37,28.66 R9.2
$1N3788: length 4
  Bottom Layer w0.254: 78.26,27.42 78.26,27.42 R11.2 R10.2
$1N5400: length 3.9
  Top Layer w0.254: U11.3 74.02,9.75 v1(74.02,9.75) 74.02,7.75 D5.1
$1N5401: length 2.6
  Top Layer w0.254: 68.28,8.9 69.83,10.45 70.22,10.45

## Copper pours and planes (outline as drawn; the poured copper is in the pictures)
3.3V on Top Layer: 33.32,8.94 32.1,7.72 30.99,7.72 30.07,8.64 30.07,22 31.29,23.22 31.29,25.3 30.73,25.86 28.6,25.86 24.94,29.51 23.11,29.51 22.76,29.87 22.76,30.53 23.11,30.89 35.56,30.89 36.73,29.72 36.73,9.95 35.72,8.94
3.3V on Top Layer: 57.66,18.59 59.54,18.59 59.54,14.12 57.66,14.12
3.3V on Bottom Layer: 57.66,18.59 59.54,18.59 59.54,14.12 57.66,14.12
GND on Top Layer: 78.94,40.84 89.1,30.68 89.1,4.52 84.58,0 49.68,0 46.99,2.69 46.99,15.8 30.38,32.41 17.48,32.41 15.9,33.98 15.9,37.69 19.05,40.84
GND on Bottom Layer: 0.97,21.84 5.08,21.84 6.57,20.36 6.57,13.32 4.83,11.58 4.83,9.75 5.18,9.4 6.76,9.4 7.57,8.58 7.57,3.25 8.33,2.49 12.32,2.49 13.88,4.04 13.88,10.02 14.02,10.16 15.85,10.16 16.36,9.65 16.36,5.69 17.79,4.26 20.21,4.26 21.34,5.38 26.14,5.38 26.88,4.65 32.94,4.65 34.09,5.79 34.09,7.21 34.14,7.26 36.47,7.26 37.08,6.65 45.47,6.65 47.6,4.52 47.6,2.79 48.11,2.29 49.07,2.29 49.63,2.84 49.63,3.96 50.5,4.83 51.71,4.83 52.58,3.96 52.58,0.57 52.01,0 4.57,0 0,4.57 0,20.88
GND on Bottom Layer: 37.08,33.32 48.82,33.32 48.82,17.62 37.08,17.62
GND on Bottom Layer: 27.33,33.78 37.44,33.78 37.44,31.8 27.33,31.8
GND on Bottom Layer: 32.6,33.27 36.44,33.27 36.44,31.88 32.6,31.88
GND on Bottom Layer: 28.92,32.48 33.2,32.48 33.2,30.77 28.92,30.77
VCC on Bottom Layer: 1.22,22.61 5.44,22.61 7.11,20.93 7.11,13.21 5.74,11.84 5.74,9.96 5.99,9.7 6.96,9.7 7.87,8.79 7.87,3.31 8.33,2.86 12.43,2.86 13.23,3.66 13.23,7.25 13.16,7.31 13.16,10.01 13.82,10.67 16.24,10.67 16.95,9.96 16.95,7.22 17.77,6.4 21.57,6.4 23.74,8.57 23.74,10.62 21.34,10.62 20.57,9.85 20.57,7.62 20.22,7.26 18.24,7.26 17.76,7.75 17.76,10.49 16.61,11.63 13.97,11.63 13.92,11.58 13.61,11.58 12.5,10.46 12.5,4.54 12.04,4.08 9.04,4.08 8.56,4.56 8.56,21.61 6.4,23.77 1.78,23.77 1.22,23.22
VCC on Bottom Layer: 21.59,10.41 26.98,10.41 26.98,6.6 21.59,6.6

Small or netless copper shapes (teardrops, artwork), in the pictures only: 119 on Top Layer, 184 on Bottom Layer
